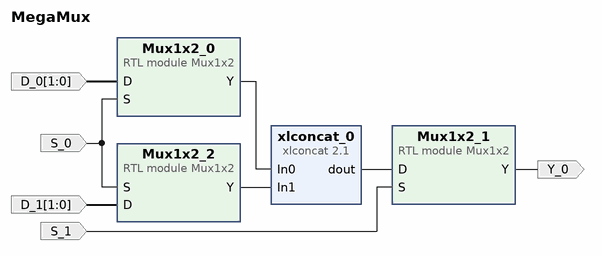
[diagram p0: block diagram of the top level]
# Vivado block design MegaMux, xc7a35tcpg236-1, Vivado 2019.1
create_bd_design MegaMux

create_bd_port -dir I -from 1 -to 0 D_0
create_bd_port -dir I -from 1 -to 0 D_1
create_bd_port -dir I S_0
create_bd_port -dir O Y_0
create_bd_port -dir I S_1

create_bd_cell -type module -reference Mux1x2 Mux1x2_0
create_bd_cell -type module -reference Mux1x2 Mux1x2_1
create_bd_cell -type module -reference Mux1x2 Mux1x2_2
create_bd_cell -type ip -vlnv xilinx.com:ip:xlconcat:2.1 xlconcat_0

# ---- connections ----

connect_bd_net [get_bd_pins Mux1x2_0/Y] [get_bd_pins xlconcat_0/In0]
connect_bd_net [get_bd_pins Mux1x2_2/Y] [get_bd_pins xlconcat_0/In1]
connect_bd_net [get_bd_pins xlconcat_0/dout] [get_bd_pins Mux1x2_1/D]
connect_bd_net -net D_0_1 [get_bd_ports D_0] [get_bd_pins Mux1x2_0/D]
connect_bd_net -net D_1_1 [get_bd_ports D_1] [get_bd_pins Mux1x2_2/D]
connect_bd_net [get_bd_pins Mux1x2_1/Y] [get_bd_ports Y_0]
connect_bd_net -net S_1_1 [get_bd_ports S_0] [get_bd_pins Mux1x2_0/S] [get_bd_pins Mux1x2_2/S]
connect_bd_net -net S_0_1 [get_bd_ports S_1] [get_bd_pins Mux1x2_1/S]

validate_bd_design
save_bd_design
